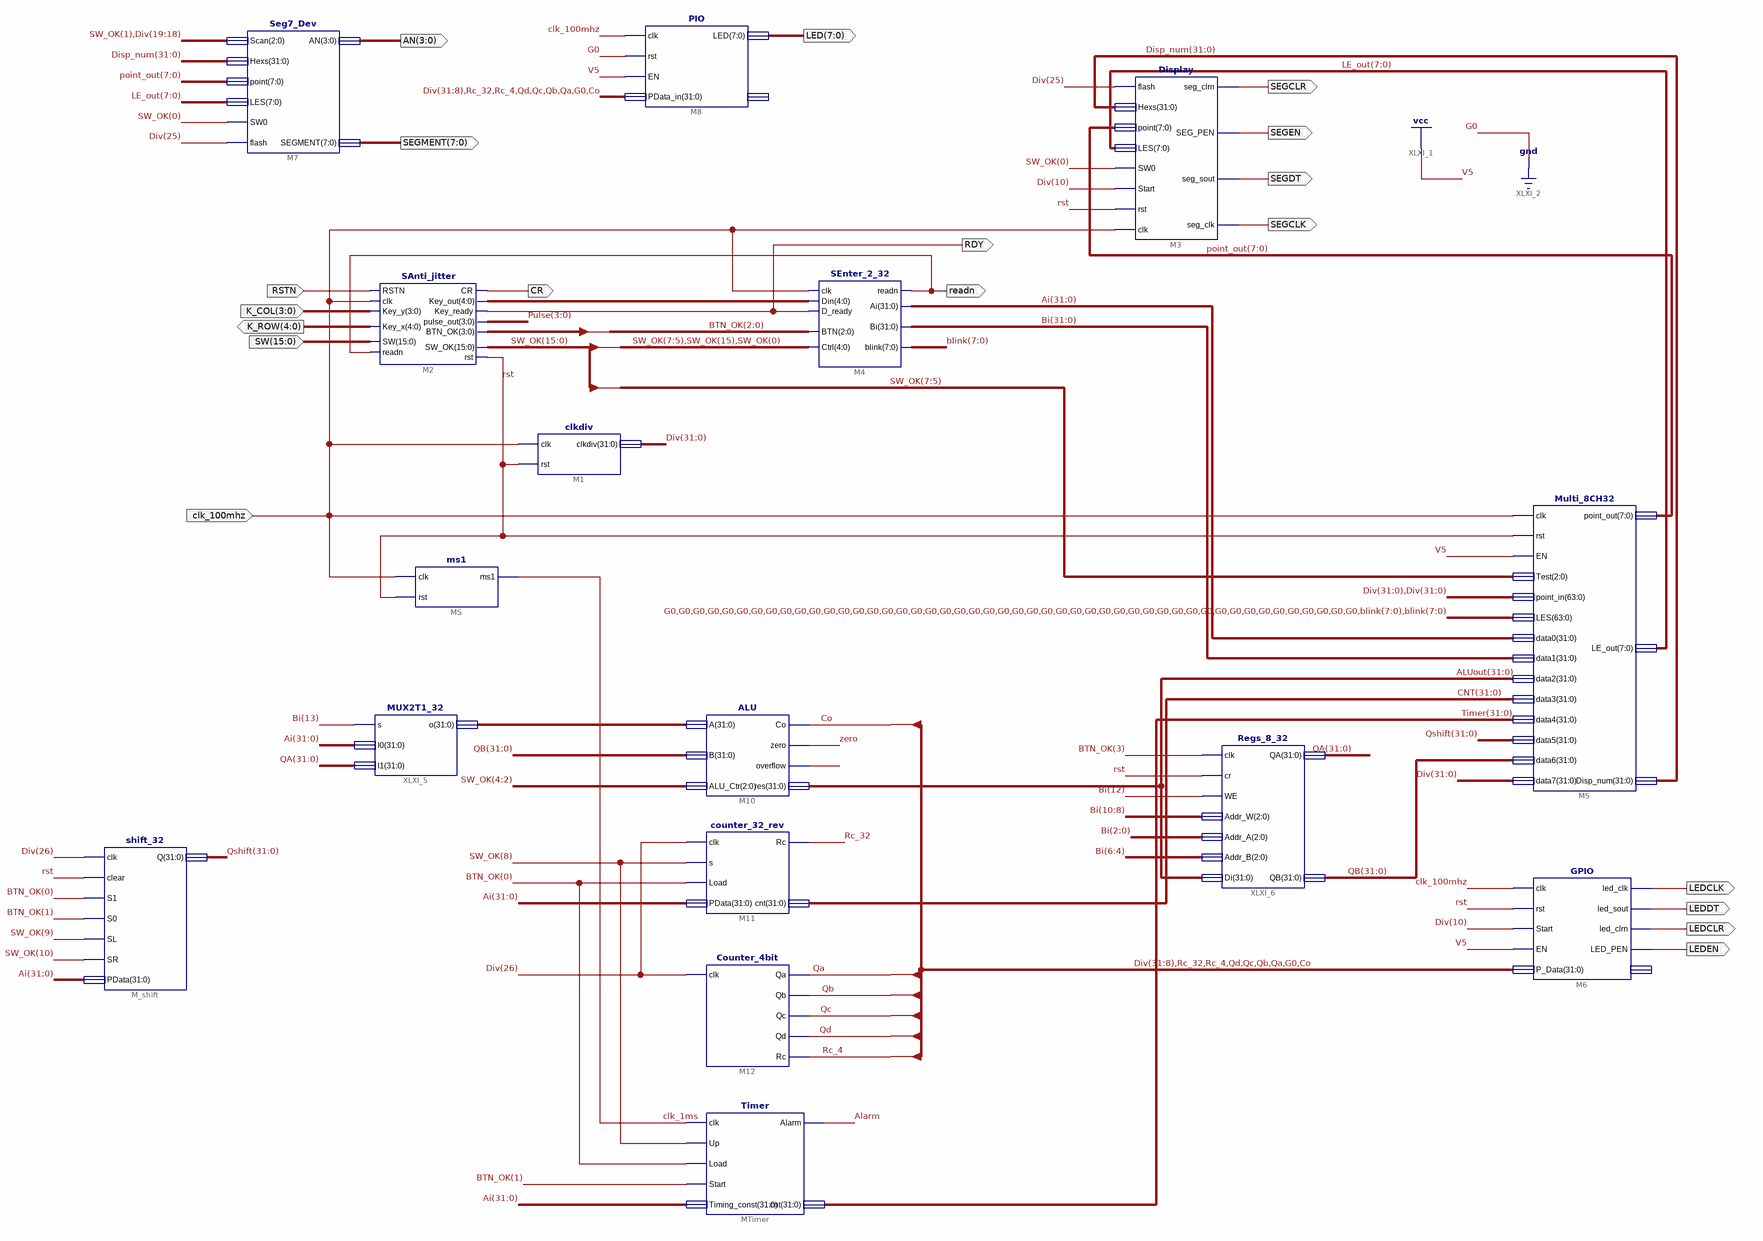
[diagram p0: schematic sheet 1]
// Xilinx ISE schematic Frame.sch (kintex7) as structural Verilog: 16 symbols, 19 ports
module Frame (
  input  RSTN,
  input  [3:0] K_COL,
  input  [15:0] SW,
  input  clk_100mhz,
  output [4:0] K_ROW,
  output readn,
  output RDY,
  output CR,
  output SEGCLR,
  output SEGEN,
  output SEGDT,
  output SEGCLK,
  output LEDCLK,
  output LEDDT,
  output LEDCLR,
  output LEDEN,
  output [7:0] LED,
  output [7:0] SEGMENT,
  output [3:0] AN
);

  wire Alarm, clk_1ms, Co, Qa_1bit, Qb_1bit, Qc, Qd, Rc_4, Rc_32, rst, XLXN_59, zero;
  wire [3:0] BTN_OK, Pulse;
  wire [4:0] XLXN_25;
  wire [7:0] blink, LE_out, point_out;
  wire [15:0] SW_OK;
  wire [31:0] Ai, ALUout, Bi, CNT, Disp_num, Div, Qa, Qb, Qshift, Timer, XLXN_89;

  SAnti_jitter M2 (
    .SW(SW), .readn(readn), .Key_y(K_COL), .Key_x(K_ROW), .RSTN(RSTN), .clk(clk_100mhz), .Key_out(XLXN_25),
    .Key_ready(RDY), .CR(CR), .rst(rst), .SW_OK(SW_OK), .pulse_out(Pulse), .BTN_OK(BTN_OK));
  Seg7_Dev M7 (
    .Scan({SW_OK[1], Div[19:18]}), .Hexs(Disp_num), .point(point_out), .LES(LE_out), .flash(Div[25]),
    .SW0(SW_OK[0]), .AN(AN), .SEGMENT(SEGMENT));
  PIO M8 (
    .clk(clk_100mhz), .rst(1'b0), .EN(1'b1),
    .PData_in({Div[31:8], Rc_32, Rc_4, Qd, Qc, Qb_1bit, Qa_1bit, 1'b0, Co}), .LED(LED));  // open: GPIOf0
  Display M3 (
    .flash(Div[25]), .Hexs(Disp_num), .point(point_out), .LES(LE_out), .SW0(SW_OK[0]), .Start(Div[10]),
    .rst(rst), .clk(clk_100mhz), .seg_clrn(SEGCLR), .SEG_PEN(SEGEN), .seg_sout(SEGDT), .seg_clk(SEGCLK));
  Multi_8CH32 M5 (
    .clk(clk_100mhz), .rst(rst), .EN(1'b1), .Test(SW_OK[7:5]), .point_in({Div, Div}),
    .LES({{48{1'b0}}, blink, blink}), .data0(Ai), .data1(Bi), .data2(ALUout), .data3(CNT), .data4(Timer),
    .data5(Qshift), .data6(Qb), .data7(Div), .point_out(point_out), .LE_out(LE_out), .Disp_num(Disp_num));
  GPIO M6 (
    .clk(clk_100mhz), .rst(rst), .Start(Div[10]), .EN(1'b1),
    .P_Data({Div[31:8], Rc_32, Rc_4, Qd, Qc, Qb_1bit, Qa_1bit, 1'b0, Co}), .led_clk(LEDCLK),
    .led_sout(LEDDT), .led_clrn(LEDCLR), .LED_PEN(LEDEN));  // open: GPIOf0
  clkdiv M1 (.clk(clk_100mhz), .rst(rst), .clkdiv(Div));
  SEnter_2_32 M4 (
    .readn(readn), .Ai(Ai), .Bi(Bi), .blink(blink), .Din(XLXN_25), .D_ready(RDY), .clk(clk_100mhz),
    .Ctrl({SW_OK[7:5], SW_OK[15], SW_OK[0]}), .BTN(BTN_OK[2:0]));
  ALU M10 (.A(XLXN_89), .B(Qb), .ALU_Ctr(SW_OK[4:2]), .Co(Co), .zero(zero), .overflow(XLXN_59), .res(ALUout));
  Counter_4bit M12 (.clk(Div[26]), .Qa(Qa_1bit), .Qb(Qb_1bit), .Qc(Qc), .Qd(Qd), .Rc(Rc_4));
  counter_32_rev M11 (.clk(Div[26]), .s(SW_OK[8]), .Load(BTN_OK[0]), .PData(Ai), .Rc(Rc_32), .cnt(CNT));
  ms1 MS (.clk(clk_100mhz), .rst(rst), .ms1(clk_1ms));
  Timer MTimer (
    .clk(clk_1ms), .Up(SW_OK[8]), .Load(BTN_OK[0]), .Start(BTN_OK[1]), .Timing_const(Ai), .Alarm(Alarm),
    .cnt(Timer));
  MUX2T1_32 XLXI_5 (.s(Bi[13]), .I0(Ai), .I1(Qa), .o(XLXN_89));
  Regs_8_32 XLXI_6 (
    .clk(BTN_OK[3]), .cr(rst), .WE(Bi[12]), .Addr_W(Bi[10:8]), .Addr_A(Bi[2:0]), .Addr_B(Bi[6:4]),
    .Di(ALUout), .QA(Qa), .QB(Qb));
  shift_32 M_shift (
    .clk(Div[26]), .clear(rst), .S1(BTN_OK[0]), .S0(BTN_OK[1]), .SL(SW_OK[9]), .SR(SW_OK[10]), .PData(Ai),
    .Q(Qshift));
endmodule
